# Altium schematic sheet LED_aluminum.SchDoc: Sample Sheet Title
size B; Date: MM/DD/YYYY; Author: Sample Author; Organization: ORGANIZATION; Address1: ADDRESS 1; Address2: ADDRESS 2; Address3: ADDRESS 3; Address4: ADDRESS 4; Revision: -; SheetNumber: 1; SheetTotal: 1; ENG_APP_DATE: --/--/--; DSN_APP_DATE: --/--/--; CHK_APP_DATE: --/--/--
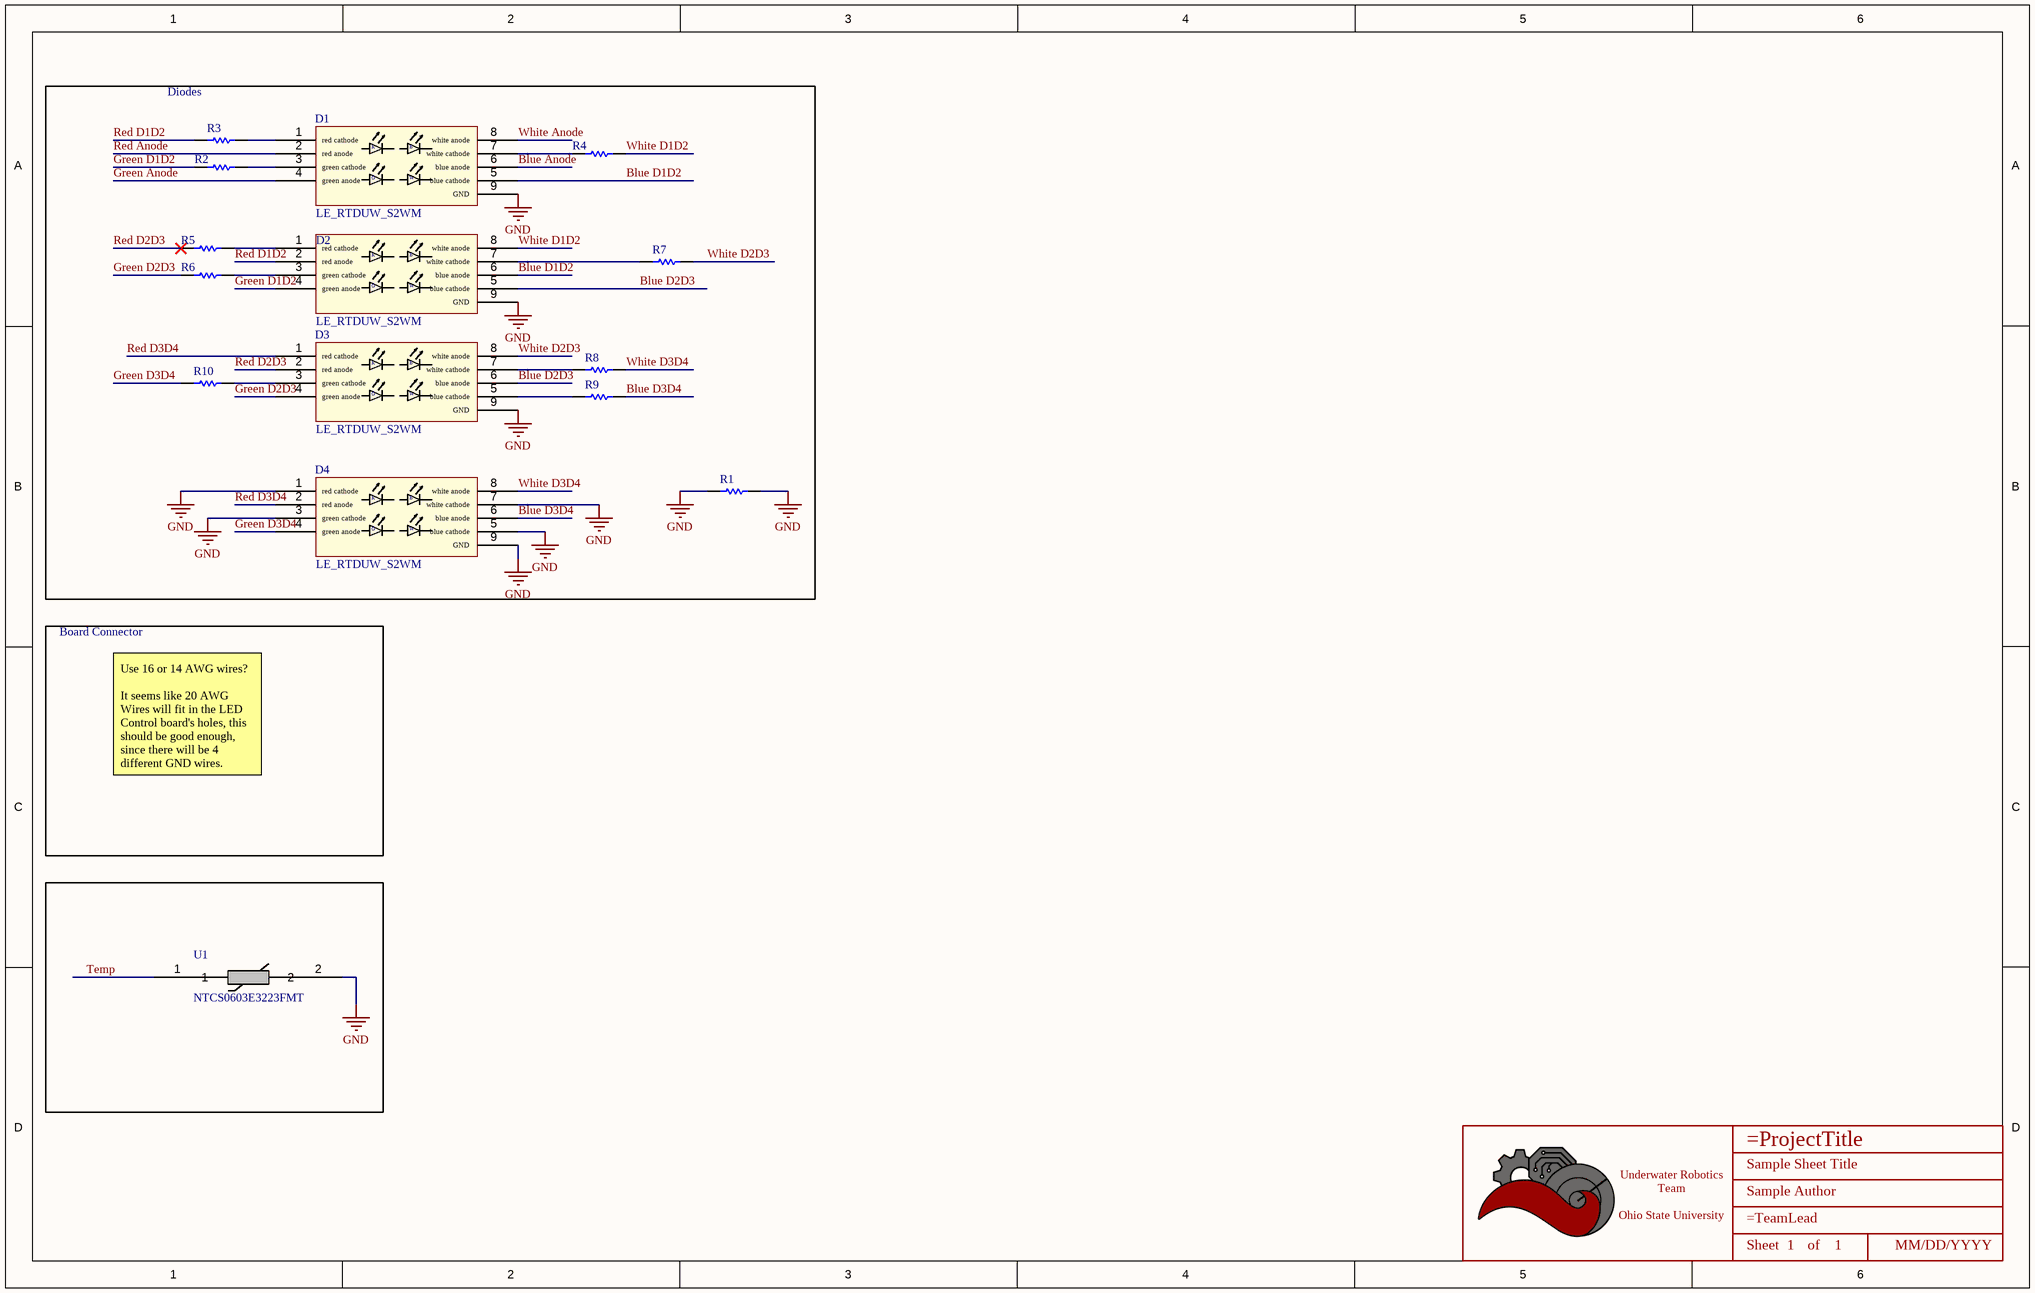
[diagram p0: LED_aluminum.SchDoc]

## Parts
*  Title_Block  [LOGO]  (value not drawn)  (graphical)
D1  LE_RTDUW_S2WM  [LE_RTDUW_S2WM]
D2  LE_RTDUW_S2WM  [LE_RTDUW_S2WM]
D3  LE_RTDUW_S2WM  [LE_RTDUW_S2WM]
D4  LE_RTDUW_S2WM  [LE_RTDUW_S2WM]
R1  Jumper 2512(6432)  [RESC2512(6432)_L]  (value not drawn)
R2  ERJ-8GEY0R00V  [RESC3216X70X50NL05T20]  (value not drawn)
R3  Jumper 2512(6432)  [RESC2512(6432)_L]  (value not drawn)
R4  ERJ-8GEY0R00V  [RESC3216X70X50NL05T20]  (value not drawn)
R5  ERJ-8GEY0R00V  [RESC3216X70X50NL05T20]  (value not drawn)
R6  Jumper 2512(6432)  [RESC2512(6432)_L]  (value not drawn)
R7  ERJ-8GEY0R00V  [RESC3216X70X50NL05T20]  (value not drawn)
R8  ERJ-8GEY0R00V  [RESC3216X70X50NL05T20]  (value not drawn)
R9  Jumper 2512(6432)  [RESC2512(6432)_L]  (value not drawn)
R10  ERJ-8GEY0R00V  [RESC3216X70X50NL05T20]  (value not drawn)
U1  NTCS0603E3223FMT  [NTCS0603_VIS]

## Blocks framed on the sheet
Diodes: D1-D4 R1-R10

## Nets
GND: D1.9(GND) D2.9(GND) D3.9(GND) D4.1(red_cathode) D4.3(green_cathode) D4.5(blue_cathode) D4.7(white_cathode) D4.9(GND) R1.1 R1.2 U1.2
Blue Anode: D1.6(blue_anode)
Blue D1D2: D1.5(blue_cathode) D2.6(blue_anode)
Blue D2D3: D2.5(blue_cathode) D3.6(blue_anode)
Blue D3D4: D4.6(blue_anode) R9.2
Green Anode: D1.4(green_anode)
Green D1D2: D2.4(green_anode) R2.1
Green D2D3: D3.4(green_anode) R6.1
Green D3D4: D4.4(green_anode) R10.1
Red Anode: D1.2(red_anode)
Red D1D2: D2.2(red_anode) R3.1
Red D2D3: D3.2(red_anode) R5.1
Red D3D4: D3.1(red_cathode) D4.2(red_anode)
Temp: U1.1
White Anode: D1.8(white_anode)
White D1D2: D2.8(white_anode) R4.2
White D2D3: D3.8(white_anode) R7.2
White D3D4: D4.8(white_anode) R8.2
NetD1_1: D1.1(red_cathode) R3.2
NetD1_3: D1.3(green_cathode) R2.2
NetD1_7: D1.7(white_cathode) R4.1
NetD2_1: D2.1(red_cathode) R5.2
NetD2_3: D2.3(green_cathode) R6.2
NetD2_7: D2.7(white_cathode) R7.1
NetD3_3: D3.3(green_cathode) R10.2
NetD3_5: D3.5(blue_cathode) R9.1
NetD3_7: D3.7(white_cathode) R8.1

## Notes on the sheet
- Board Connector
- Use 16 or 14 AWG wires?
  It seems like 20 AWG Wires will fit in the LED Control board's holes, this should be good enough, since there will be 4 different GND wires.
- DWG. NO.
- REV.
- SHT.
- THIS DOCUMENT AND THE DATA DISCLOSED HEREIN OR HEREWITH IS THE PROPERTY OF ALTIUM LIMITED AND MAY BE FREELY DISTRIBUTED IN WHOLE. NO RIGHTS ARE RESERVED OR EXPRESS OR IMPLIED WARANTEE GIVEN.
- REVISION
- DESCRIPTION
- DATE
- APPROVED
- ENG:
- APPROVALS
- PROJECT
- DSN:
- CHK:
- REFERENCE DOCUMENTS
- PROJECT REVISION:
- TITLE
- DOCUMENT REVISION:
- DESIGN ITEM:
- BOM:
- FAB DWG:
- PCB DWG:
- ASSY DWG:
- SCALE:
- SIZE
- B
- CAGE CODE
- FILE NAME
- DWG NO.
- SHEET
- OF
- REV
- (in symbol LE_RTDUW_S2WM) R; B; G; W
- (in symbol Title_Block) Underwater Robotics Team / Ohio State University; Sheet; of

## Library data of the parts
* = Title_Block: UWRT Schematic Title Block Template / Created June 2021, Dylan Trainor
D1-D4 = LE_RTDUW_S2WM: LED OSTAR RGBW 625/527/453NM SMD; Supplier 1: Mouser; Supplier Part Number 1: 720-LERTDUWS2WMA2120
R1 R3 R6 R9 = CMP-1018-00001-1: Jumper 2512 (6432 Metric); Tolerance: None; Case-EIA: 2512; Value: 0.00 Ohm; Case-Metric: 6432; Technology: SMT; Power: None
R2 R4 R5 R7 R8 R10 = CMP-2003-00541-1: Manufacturer: Panasonic; Part Number: ERJ-8GEY0R00V
U1 = CMP-00030-42631939-1: NTCS0603E3223FMT Thermistor NTC 22K Ohm 1% 2-Pin 0603 Surface Mount Solder Pad 3730K -4.5 to -4 T/R Automotive; Resistance: 22kΩ; Power Dissipation: 125mW; Contact Plating: Tin; Accuracy: 1%; Height: 800µm; Max Operating Temperature: 150°C; Termination: SMD/SMT; Case Code (Imperial): 0603; Mount: Surface Mount; Case/Package: 0603; Radiation Hardening: No; Schedule B: 8533400080, 8533400080; Min Operating Temperature: -40°C; Case Code (Metric): 1608; RoHS: Compliant; NexarPartId: 42631939; Number of Pins: 2; Depth: 800µm; Length: 1.6mm; Power Rating: 125mW; Tolerance: 1%; REACH SVHC: Unknown; Width: 1.6mm